# Altium project PMBoard.PrjPcb
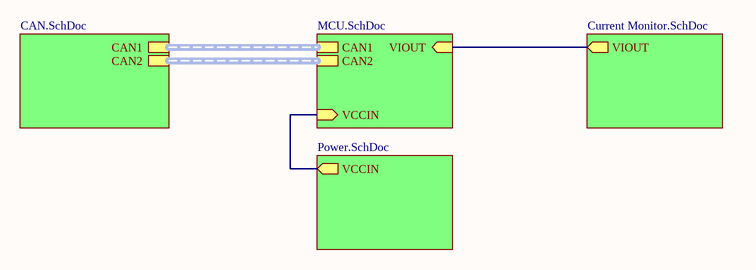
[diagram p0: TOP.SchDoc]
6 sheets, 71 parts. Net scope: hierarchical (ports join the sheet entries above them; power ports are global).
Board file: PCB.PcbDoc
Sheets:
  TOP.SchDoc
    Current Monitor = Current Monitor.SchDoc
    MCU = MCU.SchDoc
    Power = Power.SchDoc
      Buck = Buck.SchDoc
    CAN = CAN.SchDoc

## Sheet TOP.SchDoc: TOP.SchDoc
size A4; Organization: Altium Limited; Address1: L3, 12a Rodborough Rd; Address2: Frenchs Forest; Address3: NSW; Address4: Australia 2086

### Sub-sheets
CAN = CAN.SchDoc: CAN1, CAN2
Current Monitor = Current Monitor.SchDoc: VIOUT (out)
MCU = MCU.SchDoc: CAN1, CAN2, VIOUT (in), VCCIN (in)
Power = Power.SchDoc: VCCIN (out)

### Nets
VIOUT: sheet Current Monitor/VIOUT, sheet MCU/VIOUT
NetR16_1: sheet MCU/VCCIN, sheet Power/VCCIN

### Buses and harness runs
harness sheet CAN/CAN1 = sheet MCU/CAN1
harness sheet CAN/CAN2 = sheet MCU/CAN2

### Notes on the sheet
- Title
- Size:
- Date:
- A4
- Number:
- Time:
- Revision:
- Sheet
- of
- File:

## Sheet Current Monitor.SchDoc: Current Monitor.SchDoc
size A4; Organization: Altium Limited; Address1: L3, 12a Rodborough Rd; Address2: Frenchs Forest; Address3: NSW; Address4: Australia 2086
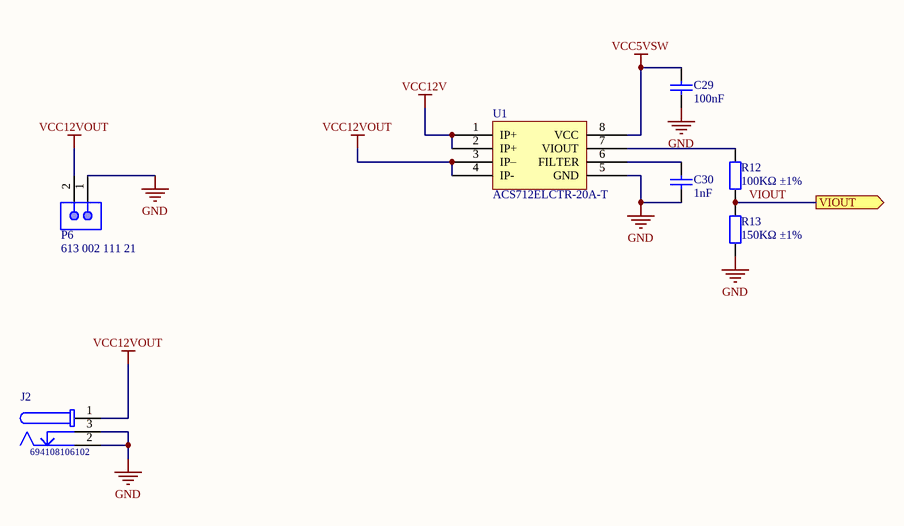
[diagram p1: Current Monitor.SchDoc]

### Parts
C29  100nF  [0402_C]
C30  1nF  [0402_C]
J2  694108106102  [694108106102]
P6  613 002 111 21  [WE-61300211121_V]
R12  100KΩ ±1%  [0402_R]
R13  150KΩ ±1%  [0402_R]
U1  ACS712ELCTR-20A-T  [SOIC-8_150mil]

### Ports
VIOUT (out)

### Nets
GND: C29.1 C30.1 J2.2 J2.3 P6.1 R13.1 U1.5(GND)
VCC5VSW: C29.2 U1.8(VCC)
VCC12V: U1.1(IP+) U1.2(IP+)
VCC12VOUT: J2.1 P6.2 U1.3(IP–) U1.4(IP-)
VIOUT: R12.1 R13.2 ; port VIOUT
NetC30_2: C30.2 U1.6(FILTER)
NetR12_2: R12.2 U1.7(VIOUT)

### Notes on the sheet
- Title
- Size:
- Date:
- A4
- Number:
- Time:
- Revision:
- Sheet
- of
- File:

### Library data of the parts
C29 = 0402 100nF (104) 10% 16V: Chip capacitors; Manufacturer: Samsung Electro-Mechanics; PartNumber: CL05B104KO5NNNC; Tolerance: 10%; Voltage: 16V; ComponentLink1Description: Supplier link; ComponentLink1URL: http://www.szlcsc.com/product/details_1877.html; Package: 0402; Supplier: LC; SuppliersPartNumber: C1525; Capacitance: 100nF
C30 = 0402 1nF (102) 10% 50V: Chip capacitor; Manufacturer: Guangdong Fenghua Advanced Tech; PartNumber: 0402B102K500NT; Tolerance: 10%; Voltage: 50V; ComponentLink1Description: Supplier link; ComponentLink1URL: http://www.szlcsc.com/product/details_1875.html; Package: 0402; Supplier: LC; SuppliersPartNumber: C1523; Capacitance: 1nF
J2 = CMP-1502-00180-1: DC Power Jack Connector with 4 soldering pads & Pegs WR-DC, Male, Right Angled, SMT, 5 A, 24 V; Manufacturer: Wurth Elektronik; Opening Diameter: 6.4mm; Plug Inner Diameter: 2.55mm; Working Voltage: 24V; Rated Current: 5A; Plug Outer Diameter: 5.5mm; Gender: Male; Mounting Technology: SMT; Packaging: TapeandReel; Orientation: RightAngled; Datasheet URL: http://katalog.we-online.de/em/datasheet/6941xx106102.pdf; Package Reference: 694108106102; Publisher: WurthElektronik; Manufacturer URL: http://www.we-online.de; Part Number: 694108106102; Operating Temperature: -40to85degC
P6 = CMP-1712-00002-3: Male Header, Pitch 2.54 mm, 1 x 2 Position, Height 8.54 mm, Tail Length 3 mm, -40 to 105 degC, RoHS, Bulk; Mounting Technology: Through Hole; Packaging: Bulk; Pins: 2; REACH SVHC: No SVHC; PartNumber: 613 002 111 21; PackageDescription: Male Header, Pitch 2.54 mm, 1 x 2 Position, Height 8.54 mm, Tail Length 3 mm; ComponentLink1Description: Manufacturer URL; Max Operating Temperature: 125 degC; ComponentLink1URL: https://www.we-online.com/; ComponentLink2Description: Datasheet; Mount: Through Hole; DatasheetVersion: Rev. J; Min Operating Temperature: -40 degC; ComponentLink2URL: http://katalog.we-online.de/em/datasheet/6130xx11121.pdf; RoHSCompliant: True
R12 = 0402 100K (1003) 1%: Chip resistor; Manufacturer: Uniroyal Elec; PartNumber: 0402WGF1003TCE; Power: 1/16W; ComponentLink1Description: Supplier link; ComponentLink1URL: http://www.szlcsc.com/product/details_26484.html; Package: 0402; Supplier: LC; SuppliersPartNumber: C25741; Resistance: 100KΩ; Tolerance: 1%
R13 = 0402 150K (1503) 1%: Chip resistor; Manufacturer: Uniroyal Elec; PartNumber: 0402WGF1503TCE; Power: 1/16W; ComponentLink1Description: Supplier link; ComponentLink1URL: http://www.szlcsc.com/product/details_26498.html; Package: 0402; Supplier: LC; SuppliersPartNumber: C25755; Resistance: 150KΩ; Tolerance: 1%
U1 = ACS712ELCTR-20A-T_[C10681]: 传感器; ComponentLink1Description: 供应商链接; ComponentLink1URL: http://www.szlcsc.com/product/details_11225.html; Package: SOIC-8_150mil; Supplier: LC; SuppliersPartNumber: C10681

## Sheet MCU.SchDoc: MCU.SchDoc
size A4; Organization: Altium Limited; Address1: L3, 12a Rodborough Rd; Address2: Frenchs Forest; Address3: NSW; Address4: Australia 2086
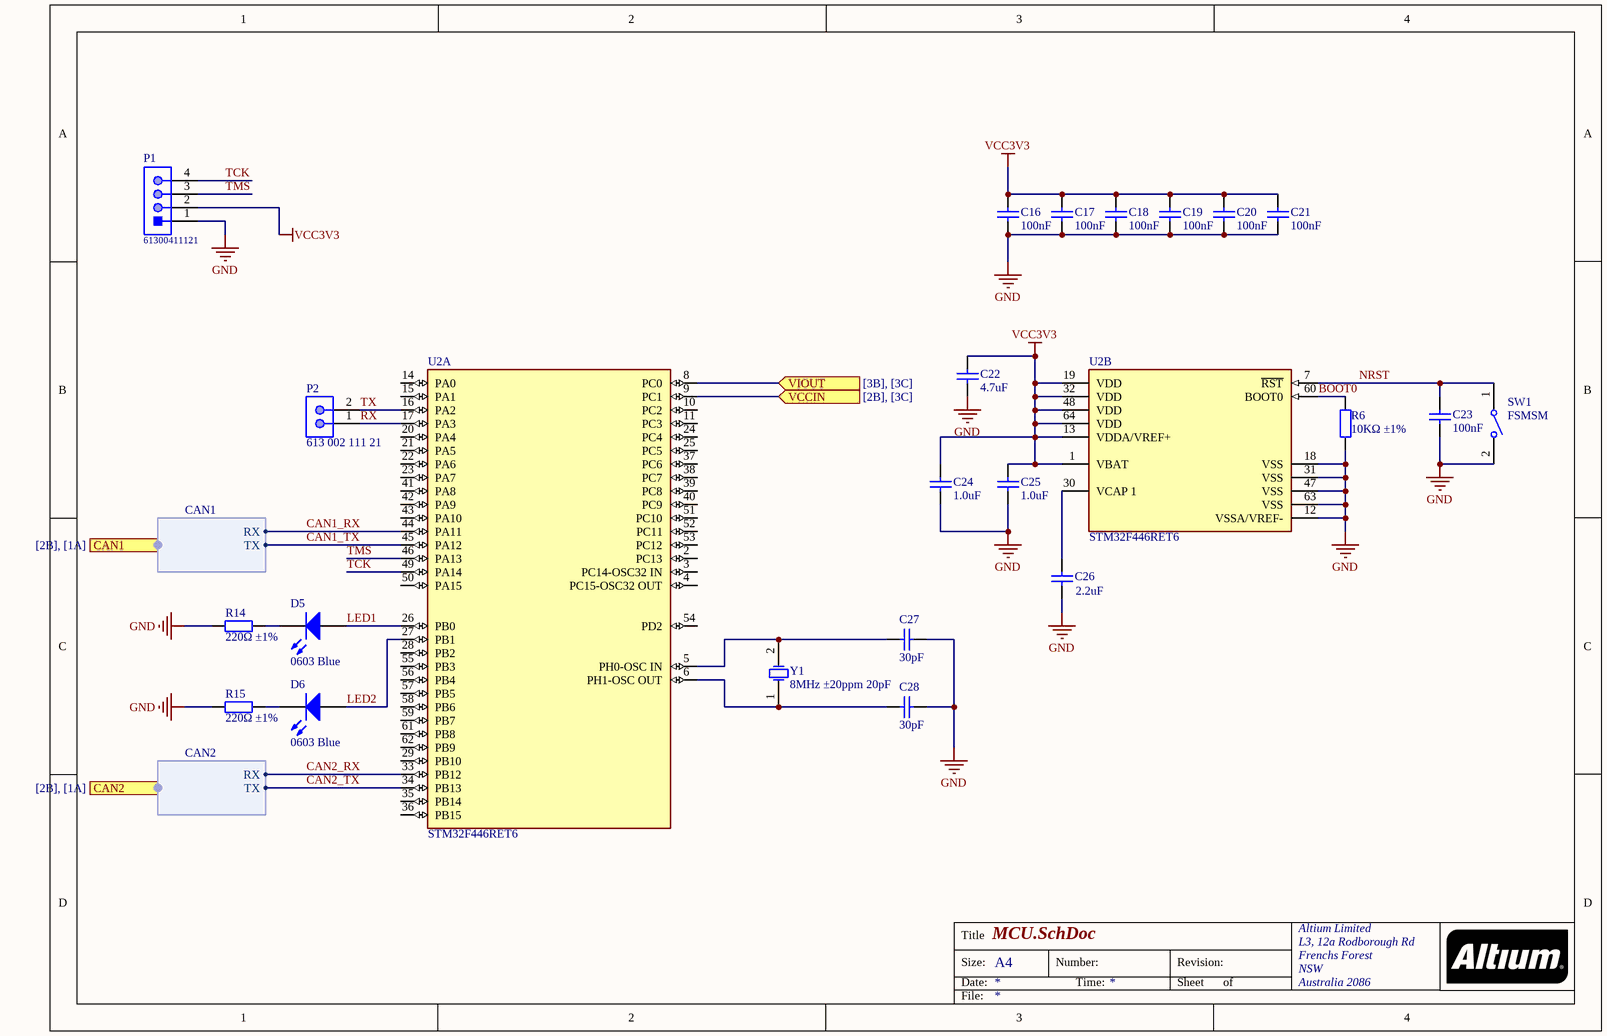
[diagram p2: MCU.SchDoc]

### Parts
C16  100nF  [0402_C]
C17  100nF  [0402_C]
C18  100nF  [0402_C]
C19  100nF  [0402_C]
C20  100nF  [0402_C]
C21  100nF  [0402_C]
C22  4.7uF  [0402_C]
C23  100nF  [0402_C]
C24  1.0uF  [0402_C]
C25  1.0uF  [0402_C]
C26  2.2uF  [0603_C]
C27  30pF  [0402_C]
C28  30pF  [0402_C]
D5  0603 Blue  [0603_LED_S1]
D6  0603 Blue  [0603_LED_S1]
P1  61300411121  [61300411121]
P2  613 002 111 21  [WE-61300211121_V]
R6  10KΩ ±1%  [0805_R]
R14  220Ω ±1%  [0402_R]
R15  220Ω ±1%  [0402_R]
SW1  FSMSM  [TECO-FSMSM-2_V]
U2  STM32F446RET6  [FP-LQFP64-5W-MFG]  (parts A,B of 2)
Y1  8MHz ±20ppm 20pF  [SMD-5032_2P]

### Ports
CAN1 (harness CAN1, see [2B], [1A]), CAN2 (harness CAN2, see [2B], [1A]), VCCIN (in, see [2B], [3C]), VIOUT (in, see [3B], [3C])

### Harnesses
CAN1: RX, TX
CAN2: RX, TX

### Nets
GND: C16.1 C17.1 C18.1 C19.1 C20.1 C21.1 C22.1 C23.1 C24.1 C25.1 C26.1 C27.2 C28.2 P1.1 R6.1 R14.1 R15.1 SW1.2 U2.12(VSSA/VREF-) U2.18(VSS) U2.31(VSS) U2.47(VSS) U2.63(VSS)
VCC3V3: C16.2 C17.2 C18.2 C19.2 C20.2 C21.2 C22.2 C24.2 C25.2 P1.2 U2.1(VBAT) U2.13(VDDA/VREF+) U2.19(VDD) U2.32(VDD) U2.48(VDD) U2.64(VDD)
BOOT0: R6.2 U2.60(BOOT0)
CAN1_RX: U2.44(PA11) ; port CAN1.RX
CAN1_TX: U2.45(PA12) ; port CAN1.TX
CAN2_RX: U2.33(PB12) ; port CAN2.RX
CAN2_TX: U2.34(PB13) ; port CAN2.TX
LED1: D5.A U2.26(PB0)
LED2: D6.A U2.27(PB1)
NRST: C23.2 SW1.1 U2.7(~{RST})
RX: P2.1 U2.17(PA3)
TCK: P1.4 U2.49(PA14)
TMS: P1.3 U2.46(PA13)
TX: P2.2 U2.16(PA2)
VIOUT: U2.8(PC0) ; port VIOUT
NetC26_2: C26.2 U2.30(VCAP_1)
NetC27_1: C27.1 U2.5(PH0-OSC_IN) Y1.2(OSC2)
NetC28_1: C28.1 U2.6(PH1-OSC_OUT) Y1.1(OSC1)
NetD5_K: D5.K R14.2
NetD6_K: D6.K R15.2
NetR16_1: U2.9(PC1) ; port VCCIN

Not connected (* = marked no-connect by the designer): U2 2(PC13) 3(PC14-OSC32_IN) 4(PC15-OSC32_OUT) 10(PC2) 11(PC3) 14(PA0) 15(PA1) 20(PA4) 21(PA5) 22(PA6) 23(PA7) 24(PC4) 25(PC5) 28(PB2) 29(PB10) 35(PB14) 36(PB15) 37(PC6) 38(PC7) 39(PC8) 40(PC9) 41(PA8) 42(PA9) 43(PA10) 50(PA15) 51(PC10) 52(PC11) 53(PC12) 54(PD2) 55(PB3) 56(PB4) 57(PB5) 58(PB6) 59(PB7) 61(PB8) 62(PB9)

### Notes on the sheet
- Title
- Size:
- Date:
- A4
- Number:
- Time:
- Revision:
- Sheet
- of
- File:

### Library data of the parts
C16-C21 C23 = 0402 100nF (104) 10% 16V: as C29 on sheet Current Monitor; ComponentLink1Description: Supplier link; ComponentLink1URL: http://www.szlcsc.com/product/details_1877.html; Package: 0402; Supplier: LC; SuppliersPartNumber: C1525; Capacitance: 100nF
C22 = 0402 4.7uF (475) 20% 10V: Chip capacitor; Manufacturer: Samsung Electro-Mechanics; PartNumber: CL05A475MP5NRNC; Tolerance: 20%; Voltage: 10V; ComponentLink1Description: Supplier link; ComponentLink1URL: http://www.szlcsc.com/product/details_24469.html; Package: 0402; Supplier: LC; SuppliersPartNumber: C23733; Capacitance: 4.7uF
C24 C25 = 0402 1.0uF (105) 10% 25V: Chip capacitor; Manufacturer: Samsung Electro-Mechanics; PartNumber: CL05A105KA5NQNC; Capacitance: 1uF; Tolerance: 10%; Voltage: 25V; ComponentLink1Description: Supplier link; ComponentLink1URL: http://www.szlcsc.com/product/details_53938.html; Package: 0402; Supplier: LC; SuppliersPartNumber: C52923
C26 = 0603 2.2uF (225) 10% 16V: Chip capacitors; Manufacturer: Samsung Electro-Mechanics; PartNumber: CL10A225KO8NNNC; Tolerance: 10%; Voltage: 16V; ComponentLink1Description: Supplier link; ComponentLink1URL: http://www.szlcsc.com/product/details_24366.html; Package: 0603; Supplier: LC; SuppliersPartNumber: C23630; Capacitance: 2.2uF
C27 C28 = 0402 30pF (300) 5% 50V: Chip capacitors; Manufacturer: Guangdong Fenghua Advanced Tech; PartNumber: 0402CG300J500NT; Tolerance: 5%; Voltage: 50V; ComponentLink1Description: Supplier link; ComponentLink1URL: http://www.szlcsc.com/product/details_1922.html; Package: 0402; Supplier: LC; SuppliersPartNumber: C1570; Capacitance: 30pF
D5 D6 = 0603 LED Blue: LED; ComponentLink1Description: 供应商链接; ComponentLink1URL: http://www.szlcsc.com/product/details_73150.html; Package: 0603; Supplier: LC; SuppliersPartNumber: C72041; Color: Blue
P1 = CMP-1502-01064-1: THT Vertical Pin Header WR-PHD, Pitch 2.54 mm, Single Row, 4 pins; Manufacturer: Wurth Elektronik; Withstanding Voltage: 500VAC; Rated Current: 3A; Working Voltage: 250VAC; Pin Number: 4; Gender: Male; Contact Resistance: 20mOhm; Pitch: 2.54mm; Manufacturer URL: http://www.we-online.de; Operating Temperature: -40to105degC; Packaging: Bag; Mounting Technology: THT; Package Reference: 61300411121; Datasheet URL: https://katalog.we-online.de/em/datasheet/6130xx11121.pdf; Publisher: WurthElektronik; Part Number: 61300411121; Row Number: Single; Orientation: Vertical
P2 = CMP-1712-00002-3: as P6 on sheet Current Monitor; Mounting Technology: Through Hole; Packaging: Bulk; Pins: 2; REACH SVHC: No SVHC; PartNumber: 613 002 111 21; PackageDescription: Male Header, Pitch 2.54 mm, 1 x 2 Position, Height 8.54 mm, Tail Length 3 mm; ComponentLink1Description: Manufacturer URL; Max Operating Temperature: 125 degC; ComponentLink1URL: https://www.we-online.com/; ComponentLink2Description: Datasheet; Mount: Through Hole; DatasheetVersion: Rev. J; Min Operating Temperature: -40 degC; ComponentLink2URL: http://katalog.we-online.de/em/datasheet/6130xx11121.pdf; RoHSCompliant: True
R6 = 0805 10K (1002) 1%: Chip resistor; Manufacturer: Uniroyal Elec; Power: 1/8W; ComponentLink1Description: Supplier link; ComponentLink1URL: http://www.szlcsc.com/product/details_18102.html; Package: 0805; Supplier: LC; SuppliersPartNumber: C17414; Tolerance: 1%
R14 R15 = 0402 220R (2200) 1%: Chip resistor; Manufacturer: Uniroyal Elec; PartNumber: 0402WGF2200TCE; Power: 1/16W; ComponentLink1Description: Supplier link; ComponentLink1URL: http://www.szlcsc.com/product/details_25834.html; Package: 0402; Supplier: LC; SuppliersPartNumber: C25091; Resistance: 220Ω; Tolerance: 1%
SW1 = CMP-2000-07511-1: FSMSM Push Button Switch, 50 mA, -35 to 85 degC, 2-Pin SMD, RoHS, Bulk; Manufacturer: TE Connectivity; Actuator Length: 1.07mm; Electrical Life: 20000Cycles; Actuator Material: Polyamide; Current Rating: 50mA; Illumination Type: Illuminated; Voltage Rating (DC): 24V; Contact Resistance: 100mOhm; Case\/Package: SMD/SMT; Operating Force: 180gf; Switch Travel: 0.25mm; Max Voltage Rating (DC): 12V; Throw Configuration: SPST; Packaging: LoosePiece; Max Operating Temperature: 85degC; ELV: Compliant; Package Description: 2-Pin Surface Mount Device, Body 6 x 3.5 mm, Pitch 9.19 mm; RoHSCompliant: true; Manufacturer URL: http://www.te.com/; Contact Plating: Silver; Contact Material: Brass; Mounting Technology: SurfaceMount; Contact Current Rating: 50mA; Datasheet Version: Rev. C2, 08/2014; Datasheet URL: http://www.te.com/commerce/DocumentDelivery/DDEController?Action=showdoc&DocId=Customer+Drawing%7F1437566-3%7FC2%7Fpdf%7FEnglish%7FENG_CD_1437566-3_C2_1437566_3_1_c.dwg.pdf%7F1437566-3; Mechanical Life: 20000Cycles; Package Reference: FSMSM; REACH SVHC: Unknown; Orientation: Straight; Min Operating Temperature: -35degC; Lead Free: LeadFree; Termination: GullWing; Package Quantity: 1000; Mount: SurfaceMount
U2 = CMP-12105-000007-1: IC MCU 32BIT 512KB FLASH 64LQFP; Manufacturer: ST; Number Of Spi Channels: 4; Ram Size: 128KBytes; Standoff Height: 0.05mm; Number Of Uart Channels: 6; Number Of Pwm Channels: 32; Max Junction Temp: +105°C; Number Of I/Os: 50; Number Of Usb Channels: 2; Frequency: 180MHz; Number Of A/D Converters: 3; Max Supply Voltage: 3.6V; Number Of Adc Channels: 16; Interface: I2C,SPI,UART,USART,CAN,USB,LIN,IrDA,I2S,Other; Memory Size: 512KBytes; Number Of Timers/Counters: 14; Min Supply Voltage: 1.7V; Core Architecture: ARM Cortex-M4; Data Bus Width: 32bits; Number Of Cores: 1; Ambient Temperature Range Low: -40°C; ComponentLink2URL: https://www.st.com/en/microcontrollers-microprocessors/stm32f446re.html; Category: IC; Height: 1.6mm; Ipc Land Pattern Name: QFP50P1200X1200X160-64; Manufacturer Part Number: STM32F446RET6; Octopart: https://octopart.com/stm32f446ret6-stmicroelectronics-52642920; Temperature Range High: +105°C; Lead Free: Yes; Mouser Description: ARM Microcontrollers - MCU High-performance and DSP with FP, ARM Cortex-M4 MCU with 512 Kbytes Flash, 180 MHz CPU, Art Accelerator, SDRAM; Digikey Description: IC MCU 32BIT 512KB FLASH 64LQFP; Ambient Temperature Range High: +85°C; Number Of I2C Channels: 4; Memory Type: FLASH; RoHS: TRUE; Automotive: No; Device Class L1: Integrated Circuits (ICs); Temperature: -40°C to +105°C; Device Class L2: Embedded Processors and Controllers; Device Class L3: Microcontrollers; Temperature Range Low: -40°C; Package: LQFP64-5W; ComponentLink2Description: Datasheet
Y1 = SMD-5032_2P 8MHz 20ppm 20pF: 贴片晶振; ComponentLink1Description: 供应商链接; ComponentLink1URL: http://www.szlcsc.com/product/details_117214.html; Package: SMD-5032_2P; Supplier: LC; SuppliersPartNumber: C115962

## Sheet Power.SchDoc: Power.SchDoc
size A4; Organization: Altium Limited; Address1: L3, 12a Rodborough Rd; Address2: Frenchs Forest; Address3: NSW; Address4: Australia 2086
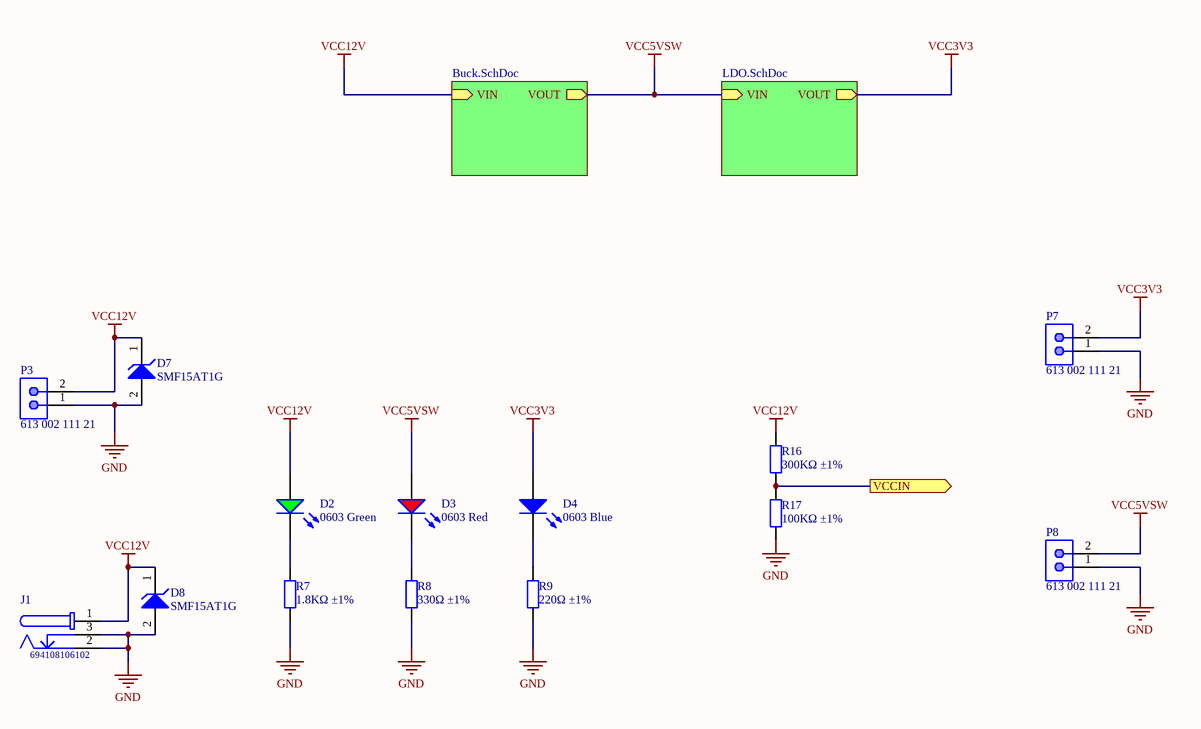
[diagram p3: Power.SchDoc]

### Parts
D2  0603 Green  [0603_LED_S1]
D3  0603 Red  [0603_LED_S1]
D4  0603 Blue  [0603_LED_S1]
D7  SMF15AT1G  [ONSC-SOD-123FL-2-498_V]
D8  SMF15AT1G  [ONSC-SOD-123FL-2-498_V]
J1  694108106102  [694108106102]
P3  613 002 111 21  [WE-61300211121_V]
P7  613 002 111 21  [WE-61300211121_V]
P8  613 002 111 21  [WE-61300211121_V]
R7  1.8KΩ ±1%  [0603_R]
R8  330Ω ±1%  [0603_R]
R9  220Ω ±1%  [0603_R]
R16  300KΩ ±1%  [0402_R]
R17  100KΩ ±1%  [0402_R]

### Sub-sheets
Buck = Buck.SchDoc: VIN (in), VOUT (out)
LDO = LDO.SchDoc (file not in this document): VIN (in), VOUT (out)

### Ports
VCCIN (out)

### Nets
GND: D7.2(A) D8.2(A) J1.2 J1.3 P3.1 P7.1 P8.1 R7.1 R8.1 R9.1 R17.1
VCC3V3: D4.A P7.2 ; sheet LDO/VOUT
VCC5VSW: D3.A P8.2 ; sheet Buck/VOUT, sheet LDO/VIN
VCC12V: D2.A D7.1(K) D8.1(K) J1.1 P3.2 R16.2 ; sheet Buck/VIN
NetD2_K: D2.K R7.2
NetD3_K: D3.K R8.2
NetD4_K: D4.K R9.2
NetR16_1: R16.1 R17.2 ; port VCCIN

### Notes on the sheet
- Title
- Size:
- Date:
- A4
- Number:
- Time:
- Revision:
- Sheet
- of
- File:

### Library data of the parts
D2 = 0603 LED Green: LED; ComponentLink1Description: 供应商链接; ComponentLink1URL: http://www.szlcsc.com/product/details_73152.html; Package: 0603; Supplier: LC; SuppliersPartNumber: C72043; Color: Green
D3 = 0603 LED Red: LED; ComponentLink1Description: 供应商链接; ComponentLink1URL: http://www.szlcsc.com/product/details_2659.html; Package: 0603; Supplier: LC; SuppliersPartNumber: C2286; Color: Red
D4 = 0603 LED Blue: LED; ComponentLink1Description: 供应商链接; ComponentLink1URL: http://www.szlcsc.com/product/details_73150.html; Package: 0603; Supplier: LC; SuppliersPartNumber: C72041; Color: Blue
D7 D8 = CMP-1061-00616-1: 200 W Transient Voltage Suppressor, 2-Pin SOD-123FL, Pb-Free, Tape and Reel; Manufacturer: On Semiconductor; V(BR) Typ (V): 17.6; IR Max (uA): 1; Direction: Unidirectional; ComponentLink2Description: Datasheet; ComponentLink1Description: Manufacturer URL; PartNumber: SMF15AT1G; PackageVersion: Rev. D, 05/2013; ComponentLink3URL: http://www.onsemi.com/pub_link/Collateral/498-01.PDF; RoHS: Pb-Free; PackageDescription: 2-Pin SOD, Body 1.65 x 2.7 mm; DatasheetVersion: Rev. 7; Packing: Tape and Reel; PackageReference: SOD-123FL-2-498; ComponentLink3Description: Package Specification; Mounting Technology: Surface Mount; ComponentLink2URL: http://www.onsemi.com/pub_link/Collateral/SMF5.0AT1-D.PDF; ComponentLink1URL: http://www.onsemi.com/
J1 = CMP-1502-00180-1: as J2 on sheet Current Monitor; Gender: Male; Mounting Technology: SMT; Packaging: TapeandReel; Orientation: RightAngled; Datasheet URL: http://katalog.we-online.de/em/datasheet/6941xx106102.pdf; Package Reference: 694108106102; Publisher: WurthElektronik; Manufacturer URL: http://www.we-online.de; Part Number: 694108106102; Operating Temperature: -40to85degC
P3 P7 P8 = CMP-1712-00002-3: as P6 on sheet Current Monitor; Mounting Technology: Through Hole; Packaging: Bulk; Pins: 2; REACH SVHC: No SVHC; PartNumber: 613 002 111 21; PackageDescription: Male Header, Pitch 2.54 mm, 1 x 2 Position, Height 8.54 mm, Tail Length 3 mm; ComponentLink1Description: Manufacturer URL; Max Operating Temperature: 125 degC; ComponentLink1URL: https://www.we-online.com/; ComponentLink2Description: Datasheet; Mount: Through Hole; DatasheetVersion: Rev. J; Min Operating Temperature: -40 degC; ComponentLink2URL: http://katalog.we-online.de/em/datasheet/6130xx11121.pdf; RoHSCompliant: True
R7 = 0603 1.8K (1801) 1%: Chip resistor; Manufacturer: Uniroyal Elec; PartNumber: 0603WAF1801T5E; Power: 1/10W; ComponentLink1Description: Supplier link; ComponentLink1URL: http://www.szlcsc.com/product/details_4584.html; Package: 0603; Supplier: LC; SuppliersPartNumber: C4177; Resistance: 1.8KΩ; Tolerance: 1%
R8 = 0603 330R (3300) 1%: Chip resistor; Manufacturer: Uniroyal Elec; PartNumber: 0603WAF3300T5E; Power: 1/10W; ComponentLink1Description: Supplier link; ComponentLink1URL: http://www.szlcsc.com/product/details_23865.html; Package: 0603; Supplier: LC; SuppliersPartNumber: C23138; Resistance: 330Ω; Tolerance: 1%
R9 = 0603 220R (2200) 1%: Chip resistor; Manufacturer: Uniroyal Elec; PartNumber: 0603WAF2200T5E; Power: 1/10W; ComponentLink1Description: Supplier link; ComponentLink1URL: http://www.szlcsc.com/product/details_23689.html; Package: 0603; Supplier: LC; SuppliersPartNumber: C22962; Resistance: 220Ω; Tolerance: 1%
R16 = 0402 300K (3003) 1%: Chip resistor; Manufacturer: Uniroyal Elec; PartNumber: 0402WGF3003TCE; Power: 1/16W; ComponentLink1Description: Supplier link; ComponentLink1URL: http://www.szlcsc.com/product/details_26517.html; Package: 0402; Supplier: LC; SuppliersPartNumber: C25774; Resistance: 300KΩ; Tolerance: 1%
R17 = 0402 100K (1003) 1%: as R12 on sheet Current Monitor; ComponentLink1Description: Supplier link; ComponentLink1URL: http://www.szlcsc.com/product/details_26484.html; Package: 0402; Supplier: LC; SuppliersPartNumber: C25741; Resistance: 100KΩ; Tolerance: 1%

## Sheet Buck.SchDoc: Buck.SchDoc
size A4; Organization: Altium Limited; Address1: L3, 12a Rodborough Rd; Address2: Frenchs Forest; Address3: NSW; Address4: Australia 2086
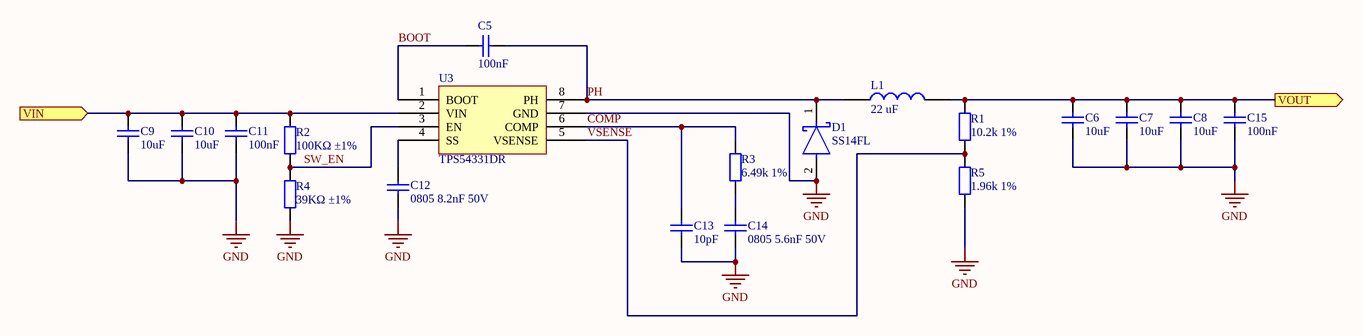
[diagram p4: Buck.SchDoc]

### Parts
C5  100nF  [0603_C]
C6  10uF  [0603_C]
C7  10uF  [0603_C]
C8  10uF  [0603_C]
C9  10uF  [0805_C]
C10  10uF  [0805_C]
C11  100nF  [0603_C]
C12  0805 8.2nF 50V  [0805_C]
C13  10pF  [0603_C]
C14  0805 5.6nF 50V  [0805_C]
C15  100nF  [0603_C]
D1  SS14FL  [FP-425AD-MFG]
L1  22 uF  [COBU-DR74-4R7-R_V]
R1  10.2k 1%  [1206_R]
R2  100KΩ ±1%  [0805_R]
R3  6.49k 1%  [0805_R]
R4  39KΩ ±1%  [0805_R]
R5  1.96k 1%  [1206_R]
U3  TPS54331DR  [SOIC-8_150mil]

### Ports
VIN (in), VOUT (out)

### Nets
GND: C6.1 C7.1 C8.1 C9.1 C10.1 C11.1 C12.1 C13.1 C14.1 C15.1 D1.2(A) R4.1 R5.1 U3.7(GND)
VCC5VSW: C6.2 C7.2 C8.2 C15.2 L1.2 R1.1 ; port VOUT
VCC12V: C9.2 C10.2 C11.2 R2.1 U3.2(VIN) ; port VIN
BOOT: C5.2 U3.1(BOOT)
COMP: C13.2 R3.2 U3.6(COMP)
PH: C5.1 D1.1(C) L1.1 U3.8(PH)
SW_EN: R2.2 R4.2 U3.3(EN)
VSENSE: R1.2 R5.2 U3.5(VSENSE)
NetC12_2: C12.2 U3.4(SS)
NetC14_2: C14.2 R3.1

### Notes on the sheet
- Title
- Size:
- Date:
- A4
- Number:
- Time:
- Revision:
- Sheet
- of
- File:

### Library data of the parts
C5 C11 C15 = 0603 100nF (104) 10% 50V: Chip capacitors; Manufacturer: YAGEO; PartNumber: CC0603KRX7R9BB104; Tolerance: 10%; Voltage: 50V; ComponentLink1Description: Supplier link; ComponentLink1URL: http://www.szlcsc.com/product/details_15331.html; Package: 0603; Supplier: LC; SuppliersPartNumber: C14663; Capacitance: 100nF
C6-C8 = 0603 10uF (106) 10% 10V: Chip capacitors; Manufacturer: Samsung Electro-Mechanics; PartNumber: CL10A106KP8NNNC; Tolerance: 10%; Voltage: 10V; ComponentLink1Description: Supplier link; ComponentLink1URL: http://www.szlcsc.com/product/details_20411.html; Package: 0603; Supplier: LC; SuppliersPartNumber: C19702; Capacitance: 10uF
C9 C10 = 0805 10uF (106) 10% 25V: Chip capacitors; Manufacturer: Samsung Electro-Mechanics; PartNumber: CL21A106KAYNNNE; Tolerance: 10%; Voltage: 25V; ComponentLink1Description: Supplier link; ComponentLink1URL: http://www.szlcsc.com/product/details_16532.html; Package: 0805; Supplier: LC; SuppliersPartNumber: C15850; Capacitance: 10uF
C12 = 0805 8.2nF 50V: PartNumber: CL21B822KBANNNC; LCSC: C170117
C13 = 0603 10pF (100) 5% 50V: Chip capacitors; Manufacturer: Samsung Electro-Mechanics; PartNumber: CL10C100JB8NNNC; Tolerance: 5%; Voltage: 50V; ComponentLink1Description: Supplier link; ComponentLink1URL: http://www.szlcsc.com/product/details_1986.html; Package: 0603; Supplier: LC; SuppliersPartNumber: C1634; Capacitance: 10pF
C14 = 0805 5.6nF 50V: PartNumber: CL21B562KBANNNC; LCSC: C153719
D1 = CMP-07162-000013-1: DIODE SCHOTTKY 40V 1A SOD123F; Manufacturer: ON Semiconductor; Max Junction Temp: +125°C; Value: 60pF; Max Surge Forward Current: 40A; Peak Reverse Current: 30uA; Device Class L3: Schottky Diodes; Reverse Voltage: 40V; Automotive: No; Temperature: -55°C to +125°C; Mouser Description: SS14FL Series 40 V 1 A Surface Mount Schottky Barrier Rectifier - SOD-123F; Octopart: https://octopart.com/ss14fl-on+semiconductor-84331601; Height: 1.08mm; Temperature Range Low: -55°C; Category: Diode; Lead Free: Yes; Device Class L1: Discrete Semiconductors; Digikey Description: DIODE SCHOTTKY 40V 1A SOD123F; RoHS: TRUE; ComponentLink2Description: Datasheet; Manufacturer Part Number: SS14FL; Forward Current: 1A; Capacitance: 60pF; Package: 425AD; Device Class L2: Diodes; Temperature Range High: +125°C; Max Repetitive Reverse Voltage: 40V; ComponentLink2URL: https://www.onsemi.com/pub/Collateral/SS14FL-D.PDF
L1 = SRP6540-5R6M
R1 = 1206 10.2k 1%: PartNumber: 1206W4F1022T5E; LCSC: C247410
R2 = 0805 100K (1003) 1%: Chip resistor; Manufacturer: Uniroyal Elec; Power: 1/8W; ComponentLink1Description: Supplier link; ComponentLink1URL: http://www.szlcsc.com/product/details_18095.html; Package: 0805; Supplier: LC; SuppliersPartNumber: C17407; Tolerance: 1%
R3 = 0805 6.49k 1%: PartNumber: 0805W8F6491T5E; LCSC: C17769
R4 = 0805 39K (3902) 1%: Chip resistor; Manufacturer: Uniroyal Elec; Power: 1/8W; ComponentLink1Description: Supplier link; ComponentLink1URL: http://www.szlcsc.com/product/details_26569.html; Package: 0805; Supplier: LC; SuppliersPartNumber: C25826; Tolerance: 1%
R5 = 1206 1.96k 1%: PartNumber: 1206W4F1022T5E; LCSC: C247410
U3 = TPS54331DR_[C9865]: DC-DC芯片; ComponentLink1Description: 供应商链接; ComponentLink1URL: http://www.szlcsc.com/product/details_10397.html; Package: SOIC-8_150mil; Supplier: LC; SuppliersPartNumber: C9865

## Sheet CAN.SchDoc: CAN.SchDoc
size A4
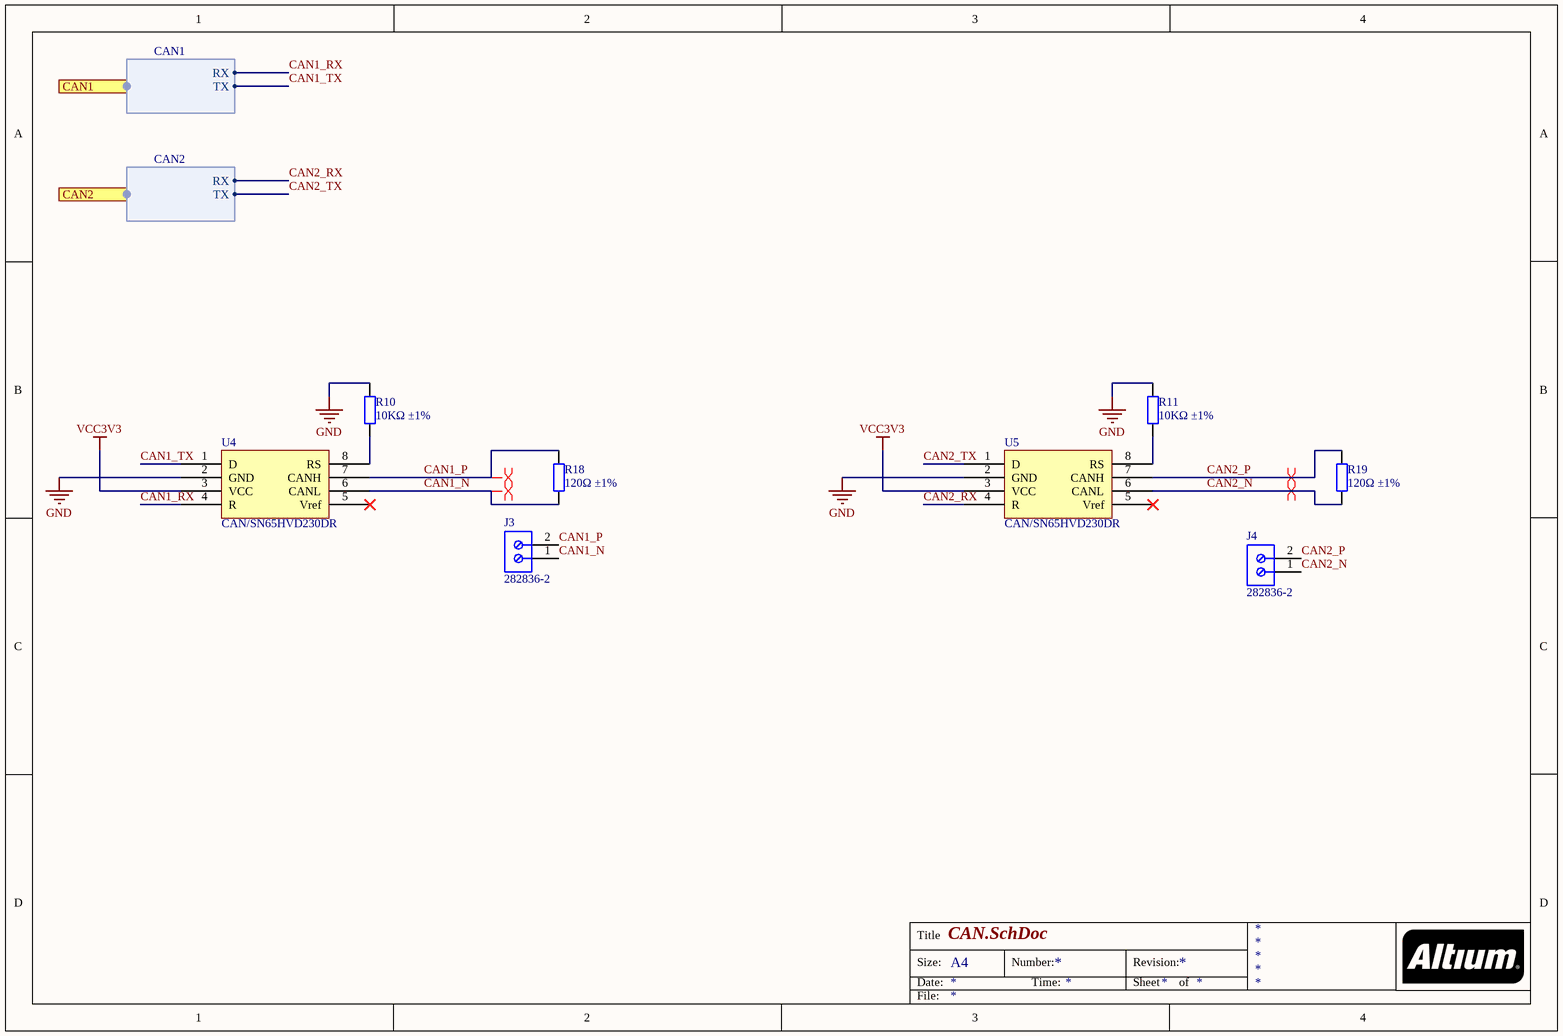
[diagram p5: CAN.SchDoc]

### Parts
J3  282836-2  [TECO-282836-2_V]
J4  282836-2  [TECO-282836-2_V]
R10  10KΩ ±1%  [0402_R]
R11  10KΩ ±1%  [0402_R]
R18  120Ω ±1%  [0402_R]
R19  120Ω ±1%  [0402_R]
U4  CAN/SN65HVD230DR  [SOIC-8_150mil]
U5  CAN/SN65HVD230DR  [SOIC-8_150mil]

### Ports
CAN1 (harness CAN1), CAN2 (harness CAN2)

### Harnesses
CAN1: RX, TX
CAN2: RX, TX

### Nets
GND: R10.2 R11.2 U4.2(GND) U5.2(GND)
VCC3V3: U4.3(VCC) U5.3(VCC)
CAN1_N: J3.1 R18.1 U4.6(CANL)
CAN1_P: J3.2 R18.2 U4.7(CANH)
CAN1_RX: U4.4(R) ; port CAN1.RX
CAN1_TX: U4.1(D) ; port CAN1.TX
CAN2_N: J4.1 R19.1 U5.6(CANL)
CAN2_P: J4.2 R19.2 U5.7(CANH)
CAN2_RX: U5.4(R) ; port CAN2.RX
CAN2_TX: U5.1(D) ; port CAN2.TX
NetR10_1: R10.1 U4.8(RS)
NetR11_1: R11.1 U5.8(RS)

Not connected (* = marked no-connect by the designer): U4 5(Vref)*; U5 5(Vref)*

### Layout directives
differential pair: CAN1_N, CAN1_P, CAN2_N, CAN2_P

### Notes on the sheet
- Title
- Size:
- Date:
- A4
- Number:
- Time:
- Revision:
- Sheet
- of
- File:

### Library data of the parts
J3 J4 = CMP-1684-00017-1: Female Header, Pitch 5 mm, 1 x 2 Position, Height 10 mm, Tail Length 3.5 mm, Rohs, Bulk; Manufacturer: TE Connectivity; Wire Gauge: 16-30AWG; Product Training Modules: Wire-to-BoardEurostyleTerminalBlocks; Clamp Material - Plating: Brass-NickelPlated; Voltage: 300V; Mating Orientation: HorizontalwithBoard; Current: 13.5A; Pitch: 0.197"(5.00mm); Screw Thread: M3; 3D Model: 282836-2.pdf; Other Names: 5ULV-02B / A98076; Dynamic Catalog: BuchananSeries; Number of Levels: 1; Torque - Screw: 0.68Nm(6Lb-In); Featured Product: EurostyleTerminalBlockConnectors; Positions Per Level: 2; Wire Termination: Screw-RisingCageClamp; Datasheet URL: http://www.te.com.cn/commerce/DocumentDelivery/DDEController?Action=showdoc&DocId=Catalog+Section%7F1308389_EUROSTYLE_TERMINAL_BLOCKS%7F0607%7Fpdf%7FEnglish%7FENG_CS_1308389_EUROSTYLE_TERMINAL_BLOCKS_0607.pdf%7F282836-2; Color: Green; Family: TerminalBlocks-WiretoBoard; RoHS Information: 282836-2StatementofCompliance; Standard Package: 300; Contact Material - Plating: Brass-TinPlated; Manufacturer URL: http://www.te.com; Housing Material: Polyamide(PA66),Nylon6/6; Features: Interlocking(Side); Package Description: Female Header, Pitch 5 mm, 1 x 2 Position, Height 10 mm, Tail Length 3.5 mm; Mounting Type: ThroughHole; Package Reference: THD; Packaging: Bulk; Series: Buchanan; Category: Connectors,Interconnects; Screw Material - Plating: Brass-NickelPlated
R10 R11 = 0402 10K (1002) 1%: Chip resistor; Manufacturer: Uniroyal Elec; PartNumber: 0402WGF1002TCE; Power: 1/16W; ComponentLink1Description: Supplier link; ComponentLink1URL: http://www.szlcsc.com/product/details_26487.html; Package: 0402; Supplier: LC; SuppliersPartNumber: C25744; Resistance: 10KΩ; Tolerance: 1%
R18 R19 = 0402 120R (1200) 1%: Chip resistor; Manufacturer: Uniroyal Elec; PartNumber: 0402WGF1200TCE; Power: 1/16W; ComponentLink1Description: Supplier link; ComponentLink1URL: http://www.szlcsc.com/product/details_25822.html; Package: 0402; Supplier: LC; SuppliersPartNumber: C25079; Resistance: 120Ω; Tolerance: 1%
U4 U5 = CAN/SN65HVD230DR_[C12084]: CAN; ComponentLink1Description: 供应商链接; ComponentLink1URL: http://www.szlcsc.com/product/details_12661.html; Package: SOIC-8_150mil; Supplier: LC; SuppliersPartNumber: C12084

## Nets that join several sheets
GND: Current Monitor (7 pins), MCU (23 pins), Power (11 pins), Buck (14 pins), CAN (R10.2 R11.2 U4.2 U5.2)
VCC3V3: MCU (16 pins), Power (D4.A P7.2), CAN (U4.3 U5.3)
VCC5VSW: Current Monitor (C29.2 U1.8), Power (D3.A P8.2), Buck (6 pins)
VCC12V: Current Monitor (U1.1 U1.2), Power (6 pins), Buck (5 pins)
CAN1_RX: MCU (U2.44), CAN (U4.4)
CAN1_TX: MCU (U2.45), CAN (U4.1)
CAN2_RX: MCU (U2.33), CAN (U5.4)
CAN2_TX: MCU (U2.34), CAN (U5.1)
NetR16_1: MCU (U2.9), Power (R16.1 R17.2)
VIOUT: Current Monitor (R12.1 R13.2), MCU (U2.8)